# Altium schematic sheet Connectors.SchDoc
size A4; SheetNumber: 3; SheetTotal: 3
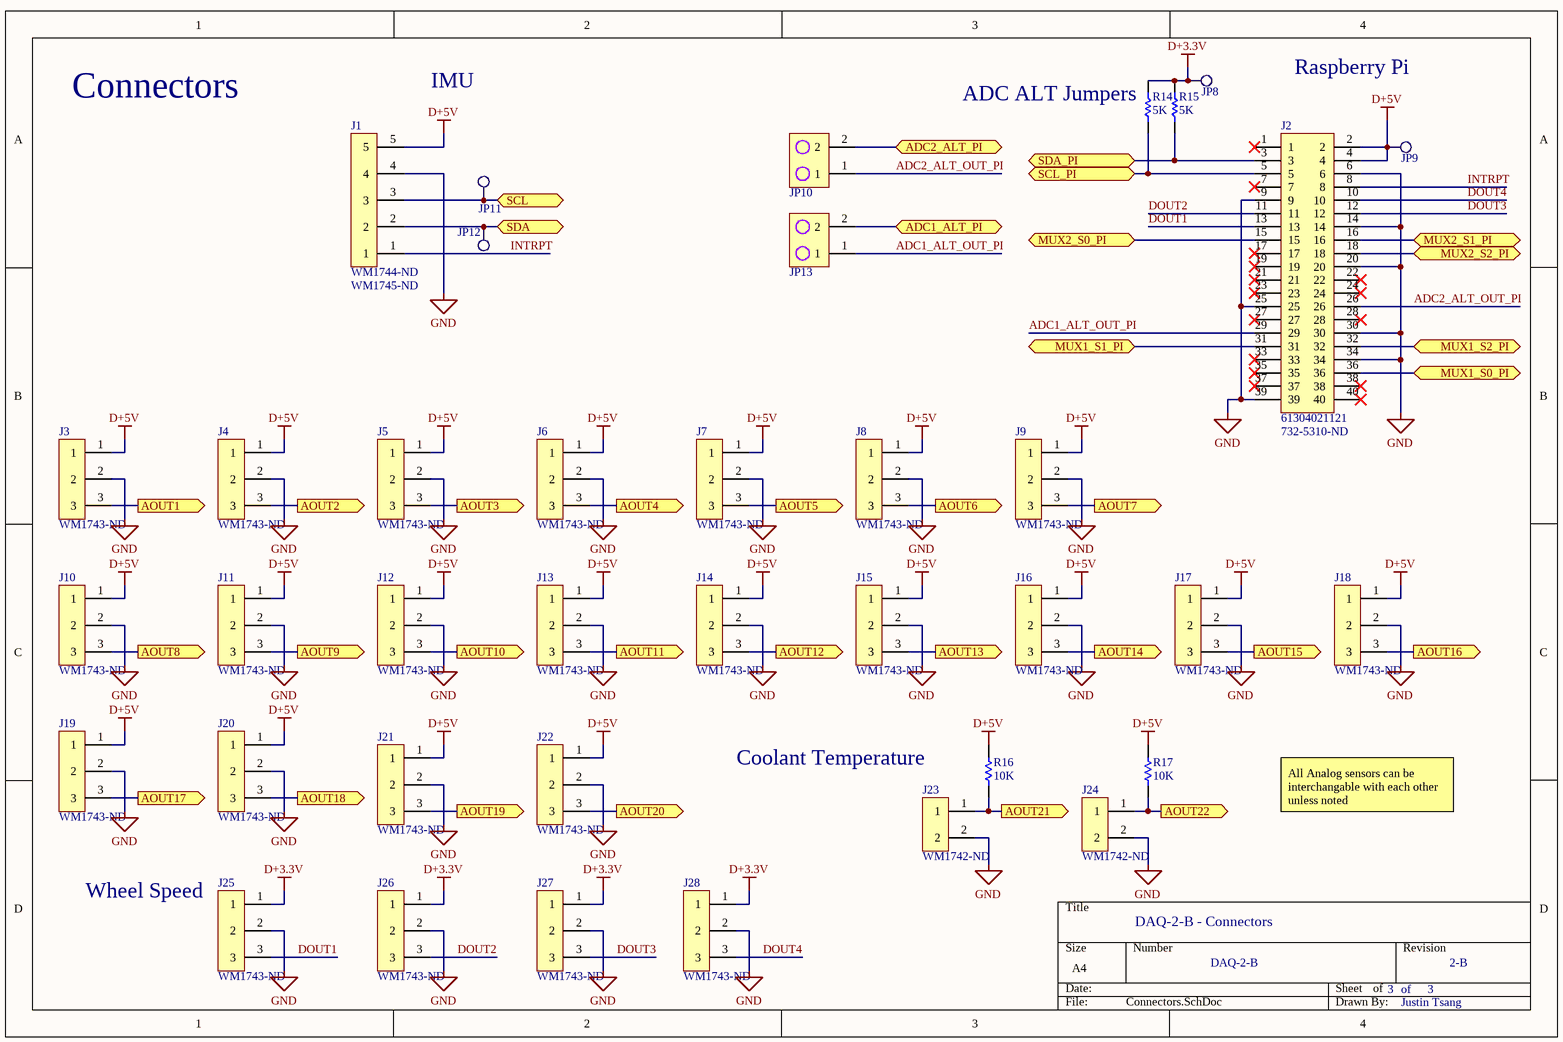
[diagram p0: Connectors.SchDoc]

## Parts
J1  WM1744-ND  Supplier Part Number 1: WM1745-ND  [1X5_1.25MM]
J2  61304021121  Supplier Part Number 1: 732-5310-ND  [2x40_Header]
J3  WM1743-ND  [1X3_1.25MM]
J4  WM1743-ND  [1X3_1.25MM]
J5  WM1743-ND  [1X3_1.25MM]
J6  WM1743-ND  [1X3_1.25MM]
J7  WM1743-ND  [1X3_1.25MM]
J8  WM1743-ND  [1X3_1.25MM]
J9  WM1743-ND  [1X3_1.25MM]
J10  WM1743-ND  [1X3_1.25MM]
J11  WM1743-ND  [1X3_1.25MM]
J12  WM1743-ND  [1X3_1.25MM]
J13  WM1743-ND  [1X3_1.25MM]
J14  WM1743-ND  [1X3_1.25MM]
J15  WM1743-ND  [1X3_1.25MM]
J16  WM1743-ND  [1X3_1.25MM]
J17  WM1743-ND  [1X3_1.25MM]
J18  WM1743-ND  [1X3_1.25MM]
J19  WM1743-ND  [1X3_1.25MM]
J20  WM1743-ND  [1X3_1.25MM]
J21  WM1743-ND  [1X3_1.25MM]
J22  WM1743-ND  [1X3_1.25MM]
J23  WM1742-ND  [1X2_1.25MM]
J24  WM1742-ND  [1X2_1.25MM]
J25  WM1743-ND  [1X3_1.25MM]
J26  WM1743-ND  [1X3_1.25MM]
J27  WM1743-ND  [1X3_1.25MM]
J28  WM1743-ND  [1X3_1.25MM]
JP8  Testpoint2  [TP2]  (value not drawn)
JP9  Testpoint2  [TP2]  (value not drawn)
JP10  732-5315-ND  [2PIN-JP]  (value not drawn)
JP11  Testpoint2  [TP2]  (value not drawn)
JP12  Testpoint2  [TP2]  (value not drawn)
JP13  732-5315-ND  [2PIN-JP]  (value not drawn)
R14  5K  [RES-0603]
R15  5K  [RES-0603]
R16  10K  [RES-0603]
R17  10K  [RES-0603]

## Ports
ADC1_ALT_PI (bidir), ADC2_ALT_PI (bidir), AOUT1 (out), AOUT2 (out), AOUT3 (out), AOUT4 (out), AOUT5 (out), AOUT6 (out), AOUT7 (out), AOUT8 (out), AOUT9 (out), AOUT10 (out), AOUT11 (out), AOUT12 (out), AOUT13 (out), AOUT14 (out), AOUT15 (out), AOUT16 (out), AOUT17 (out), AOUT18 (out), AOUT19 (out), AOUT20 (out), AOUT21 (out), AOUT22 (out), MUX1_S0_PI (bidir), MUX1_S1_PI (bidir), MUX1_S2_PI (bidir), MUX2_S0_PI (bidir), MUX2_S1_PI (bidir), MUX2_S2_PI (bidir), SCL (bidir), SCL_PI (bidir), SDA (bidir), SDA_PI (bidir)

## Nets
D+3.3V: J25.1 J26.1 J27.1 J28.1 JP8.1 R14.2 R15.2
D+5V: J1.5 J2.2 J2.4 J3.1 J4.1 J5.1 J6.1 J7.1 J8.1 J9.1 J10.1 J11.1 J12.1 J13.1 J14.1 J15.1 J16.1 J17.1 J18.1 J19.1 J20.1 J21.1 J22.1 JP9.1 R16.2 R17.2
GND: J1.4 J2.6 J2.9 J2.14 J2.20 J2.25 J2.30 J2.34 J2.39 J3.2 J4.2 J5.2 J6.2 J7.2 J8.2 J9.2 J10.2 J11.2 J12.2 J13.2 J14.2 J15.2 J16.2 J17.2 J18.2 J19.2 J20.2 J21.2 J22.2 J23.2 J24.2 J25.2 J26.2 J27.2 J28.2
ADC1_ALT_OUT_PI: J2.29 JP13.1
ADC1_ALT_PI: JP13.2 ; port ADC1_ALT_PI
ADC2_ALT_OUT_PI: J2.26 JP10.1
ADC2_ALT_PI: JP10.2 ; port ADC2_ALT_PI
AOUT1: J3.3 ; port AOUT1
AOUT2: J4.3 ; port AOUT2
AOUT3: J5.3 ; port AOUT3
AOUT4: J6.3 ; port AOUT4
AOUT5: J7.3 ; port AOUT5
AOUT6: J8.3 ; port AOUT6
AOUT7: J9.3 ; port AOUT7
AOUT8: J10.3 ; port AOUT8
AOUT9: J11.3 ; port AOUT9
AOUT10: J12.3 ; port AOUT10
AOUT11: J13.3 ; port AOUT11
AOUT12: J14.3 ; port AOUT12
AOUT13: J15.3 ; port AOUT13
AOUT14: J16.3 ; port AOUT14
AOUT15: J17.3 ; port AOUT15
AOUT16: J18.3 ; port AOUT16
AOUT17: J19.3 ; port AOUT17
AOUT18: J20.3 ; port AOUT18
AOUT19: J21.3 ; port AOUT19
AOUT20: J22.3 ; port AOUT20
AOUT21: J23.1 R16.1 ; port AOUT21
AOUT22: J24.1 R17.1 ; port AOUT22
DOUT1: J2.13 J25.3
DOUT2: J2.11 J26.3
DOUT3: J2.12 J27.3
DOUT4: J2.10 J28.3
INTRPT: J1.1 J2.8
MUX1_S0_PI: J2.36 ; port MUX1_S0_PI
MUX1_S1_PI: J2.31 ; port MUX1_S1_PI
MUX1_S2_PI: J2.32 ; port MUX1_S2_PI
MUX2_S0_PI: J2.15 ; port MUX2_S0_PI
MUX2_S1_PI: J2.16 ; port MUX2_S1_PI
MUX2_S2_PI: J2.18 ; port MUX2_S2_PI
SCL: J1.3 JP11.1 ; port SCL
SCL_PI: J2.5 R14.1 ; port SCL_PI
SDA: J1.2 JP12.1 ; port SDA
SDA_PI: J2.3 R15.1 ; port SDA_PI

Not connected (* = marked no-connect by the designer): J2 1* 7* 17* 19* 21* 22* 23* 24* 27* 28* 33* 35* 37* 38* 40*

## Notes on the sheet
- Connectors
- IMU
- (near JP10) ADC ALT Jumpers
- Raspberry Pi
- Coolant Temperature
- All Analog sensors can be interchangable with each other unless noted
- (near J25) Wheel Speed
- DAQ-2-B - Connectors
- DAQ-2-B
- of
- 2-B
- Justin Tsang

## Library data of the parts
J1 = CONN_1X5_1.25MM: CONN HEADER R/A 5POS 1.25MM; Supplier 1: Digi-Key
J2 = CONN_2X40: CONN HEADER VERT 40POS 2.54MM; Supplier 1: Digi-Key
J3-J22 J25-J28 = CONN_1X3_1.25MM: CONN HEADER R/A 3POS 1.25MM; Supplier 1: Digi-Key; Supplier Part Number 1: WM1743-ND
J23 J24 = CONN_1X2_1.25MM: CONN HEADER R/A 2POS 1.25MM; Supplier 1: Digi-Key; Supplier Part Number 1: WM1742-ND
JP8 JP9 JP11 JP12 = Testpoint2: Single layer pad TP
JP10 JP13 = 2PIN-TEST: CONN HEADER VERT 2POS 2.54MM
R14 R15 = 0603-5KR: RES SMD 4.99K OHM 1% 1/10W 0603; Manufacturer: Bourns; Manufacturer Part Number: CR0603-FX-4991ELF; Resistance: 4.99kR; Power Rating: 100mW; Voltage Rating: 50V; Temperature Coefficient: 100ppm/°C; Supplier 1: Digi-Key; Stock 1: 70557; Pricing 1: 1=0.1, 10=0.02, 25=0.0144, 50=0.011, 100=0.0082, 250=0.00624, 500=0.00498, 1000=0.00367 (USD); Mount: Surface Mount; Case/Package: 0603; Case Code (Imperial): 0603; Case Code (Metric): 1608; Contact Plating: Tin; Min Operating Temperature: -55°C; Max Operating Temperature: 155°C; Tolerance: 1%; Packaging: Tape and Reel; Package Quantity: 1; Composition: Thick Film; Termination: SMD/SMT; Number of Terminations: 2; Max Power Dissipation: 100mW; Features: Moisture Resistant; Length: 0.063inch; Height: 0.022inch; Width: 0.8mm; Thickness: 457um; Radiation Hardening: No; ComponentLink1URL: https://www.bourns.com/docs/Product-Datasheets/CHPREZTR.pdf?src-supplier=Digi-Key; ComponentLink1Description: https://www.bourns.com/docs/Product-Datasheets/CHPREZTR.pdf?src-supplier=Digi-Key; ComponentLink2URL: http://www.bourns.com/pdfs/chpreztr.pdf?src-supplier=Avnet; ComponentLink2Description: http://www.bourns.com/pdfs/chpreztr.pdf?src-supplier=Avnet; Supplier Part Number 1: CR0603-FX-4991ELFDKR-ND
R16 R17 = 0603-10KR: RES SMD 10K OHM 5% 1/10W 0603; Manufacturer: Yageo; Manufacturer Part Number: RC0603JR-0710KL; Resistance: 10kR; Voltage Rating (DC): 50V; Temperature Coefficient: 100ppm/°C; Power Rating: 100mW; Supplier 1: Digi-Key; Stock 1: 3006558; Pricing 1: 1=0.1, 10=0.019, 100=0.0077, 1000=0.00347, 2500=0.00301 (USD); Case/Package: 0603; Number of Pins: 2; Contact Plating: Tin,Matte; Case Code (Imperial): 0603; Case Code (Metric): 1608; Min Operating Temperature: -55°C; Max Operating Temperature: 155°C; Packaging: Tape and Reel; Tolerance: 5%; Composition: Thick Film; Voltage Rating: 50V; Termination: SMD/SMT; Military Standard: Not; Features: Moisture Resistant; Max Power Dissipation: 100mW; Number of Terminations: 2; Length: 0.063inch; Width: 0.031inch; Depth: 0.8mm; Height - Seated (Max): 0.022inch; Radiation Hardening: No; REACH SVHC: Unknown; Lead Free: Lead Free; ComponentLink1URL: http://www.yageo.com/documents/recent/PYu-RC_Group_51_RoHS_L_10.pdf?src-supplier=Digi-Key; ComponentLink1Description: http://www.yageo.com/documents/recent/PYu-RC_Group_51_RoHS_L_10.pdf?src-supplier=Digi-Key; Supplier Part Number 1: 311-10KGRDKR-ND